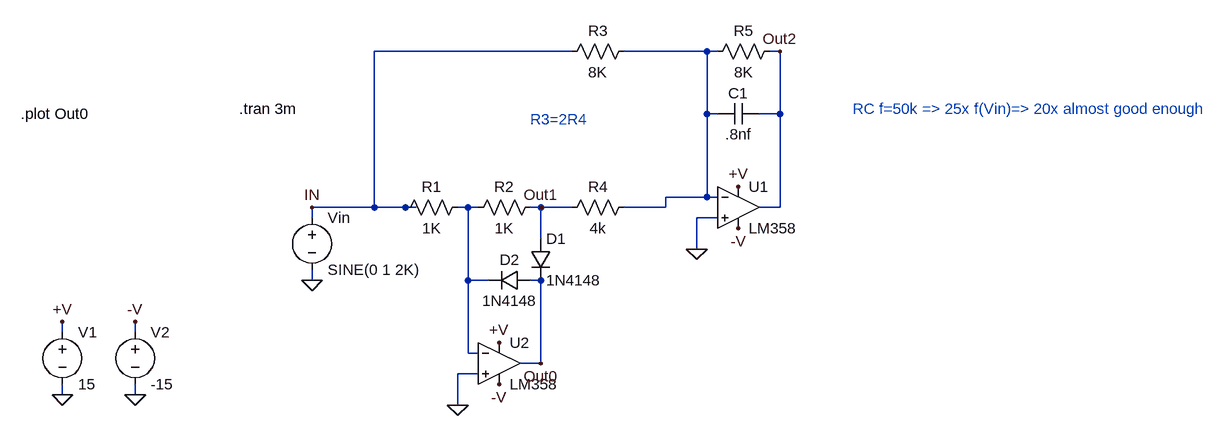
[diagram p0: schematic LM358-full-rectifier.asc]
LM358-full-rectifier.asc, the LTspice schematic file:
Version 4
SHEET 1 1728 700
WIRE 688 -1584 384 -1584
WIRE 896 -1584 768 -1584
WIRE 912 -1584 896 -1584
WIRE 1008 -1584 992 -1584
WIRE 896 -1488 896 -1584
WIRE 912 -1488 896 -1488
WIRE 1008 -1488 1008 -1584
WIRE 1008 -1488 976 -1488
WIRE 896 -1360 896 -1488
WIRE 896 -1360 832 -1360
WIRE 912 -1360 896 -1360
WIRE 384 -1344 384 -1584
WIRE 384 -1344 288 -1344
WIRE 432 -1344 384 -1344
WIRE 448 -1344 432 -1344
WIRE 528 -1344 512 -1344
WIRE 544 -1344 528 -1344
WIRE 640 -1344 624 -1344
WIRE 688 -1344 640 -1344
WIRE 832 -1344 832 -1360
WIRE 832 -1344 768 -1344
WIRE 1008 -1344 1008 -1488
WIRE 1008 -1344 976 -1344
WIRE 288 -1328 288 -1344
WIRE 912 -1328 880 -1328
WIRE 640 -1296 640 -1344
WIRE 880 -1280 880 -1328
WIRE 288 -1232 288 -1248
WIRE 528 -1232 528 -1344
WIRE 560 -1232 528 -1232
WIRE 640 -1232 624 -1232
WIRE -96 -1152 -96 -1168
WIRE 16 -1152 16 -1168
WIRE 528 -1120 528 -1232
WIRE 544 -1120 528 -1120
WIRE 640 -1104 640 -1232
WIRE 640 -1104 608 -1104
WIRE 544 -1088 512 -1088
WIRE -96 -1056 -96 -1072
WIRE 16 -1056 16 -1072
WIRE 512 -1040 512 -1088
FLAG -96 -1168 +V
FLAG 288 -1232 0
FLAG 288 -1344 IN
FLAG 576 -1136 +V
FLAG 16 -1168 -V
FLAG 576 -1072 -V
FLAG 16 -1056 0
FLAG -96 -1056 0
FLAG 512 -1040 0
FLAG 944 -1376 +V
FLAG 944 -1312 -V
FLAG 880 -1280 0
FLAG 640 -1344 Out1
FLAG 1008 -1584 Out2
FLAG 640 -1104 Out0
SYMBOL voltage -96 -1168 R0
WINDOW 123 0 0 Left 2
WINDOW 39 0 0 Left 2
SYMATTR InstName V1
SYMATTR Value 15
SYMBOL voltage 288 -1344 R0
WINDOW 123 24 146 Left 2
WINDOW 39 24 125 Left 2
SYMATTR InstName Vin
SYMATTR Value SINE(0 1 2K)
SYMBOL res 528 -1360 R90
WINDOW 0 0 56 VBottom 2
WINDOW 3 32 56 VTop 2
SYMATTR InstName R1
SYMATTR Value 1K
SYMBOL res 640 -1360 R90
WINDOW 0 0 56 VBottom 2
WINDOW 3 32 56 VTop 2
SYMATTR InstName R2
SYMATTR Value 1K
SYMBOL voltage 16 -1168 R0
WINDOW 123 24 146 Left 2
WINDOW 39 24 125 Left 2
SYMATTR InstName V2
SYMATTR Value -15
SYMBOL diode 624 -1296 R0
SYMATTR InstName D1
SYMATTR Value 1N4148
SYMBOL diode 624 -1248 R90
WINDOW 0 0 32 VBottom 2
WINDOW 3 32 32 VTop 2
SYMATTR InstName D2
SYMATTR Value 1N4148
SYMBOL res 784 -1600 R90
WINDOW 0 0 56 VBottom 2
WINDOW 3 32 56 VTop 2
SYMATTR InstName R3
SYMATTR Value 8K
SYMBOL res 784 -1360 R90
WINDOW 0 0 56 VBottom 2
WINDOW 3 32 56 VTop 2
SYMATTR InstName R4
SYMATTR Value 4k
SYMBOL res 1008 -1600 R90
WINDOW 0 0 56 VBottom 2
WINDOW 3 32 56 VTop 2
SYMATTR InstName R5
SYMATTR Value 8K
SYMBOL cap 976 -1504 R90
WINDOW 0 0 32 VBottom 2
WINDOW 3 32 32 VTop 2
SYMATTR InstName C1
SYMATTR Value .8nf
SYMBOL VG\\ZZZ\\OpAmp\\LM358 576 -1104 R0
SYMATTR InstName U2
SYMBOL VG\\ZZZ\\OpAmp\\LM358 944 -1344 R0
SYMATTR InstName U1
TEXT 176 -1496 Left 2 !.tran 3m
TEXT 624 -1480 Left 2 ;R3=2R4
TEXT 1120 -1496 Left 2 ;RC f=50k => 25x f(Vin)=> 20x almost good enough
TEXT -160 -1488 Left 2 !.plot Out0

The netlist it stands for:
* LM358-full-rectifier.asc
V1 +V 0 15
Vin IN 0 SINE(0 1 2K)
R1 N002 IN 1K
R2 Out1 N002 1K
V2 -V 0 -15
D1 Out1 Out0 1N4148
D2 Out0 N002 1N4148
R3 N001 IN 8K
R4 N001 Out1 4k
R5 Out2 N001 8K
C1 Out2 N001 .8nf
XU2 0 N002 +V -V Out0 LM358  ; pins In+ In- V+ V- OUT
XU1 0 N001 +V -V Out2 LM358  ; pins In+ In- V+ V- OUT
.model D D
.lib standard.dio
.tran 3m
* R3=2R4
* RC f=50k => 25x f(Vin)=> 20x almost good enough
.plot Out0
.backanno
.end

* Results of the author's LTspice run, read from the files saved beside the schematic
* Operating Point, zero values left out:
*   V(+v) = 15 V
*   V(-v) = -15 V
*   I(V1) = -5.935 mA
*   I(V2) = 5.935 mA
*   Ix(u3:3) = 2.968 mA
*   Ix(u3:4) = -2.968 mA
*   Ix(u1:3) = 2.968 mA
*   Ix(u1:4) = -2.968 mA
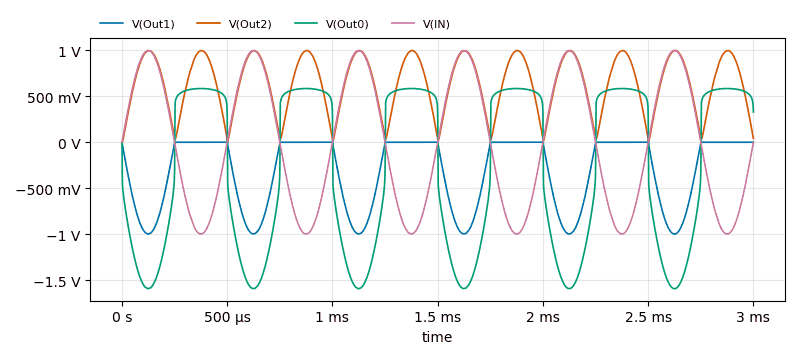
[diagram p1: Transient Analysis of LM358-full-rectifier.asc, plotted from the saved traces]
* Transient Analysis, 1 run:
*   V(Out1): min -999.9 mV, max 6.932 mV, average -317.8 mV, rms 499.6 mV, last 1.447 mV
*   V(Out2): min -5.436 mV, max 998.8 mV, average 635.4 mV, rms 706 mV, last 40.27 mV
*   V(Out0): min -1.595 V, max 584.7 mV, average -323.1 mV, rms 964.9 mV, last 329.1 mV
*   V(IN): min -1 V, max 999.9 mV, average 212 µV, rms 706.7 mV, last 0 V